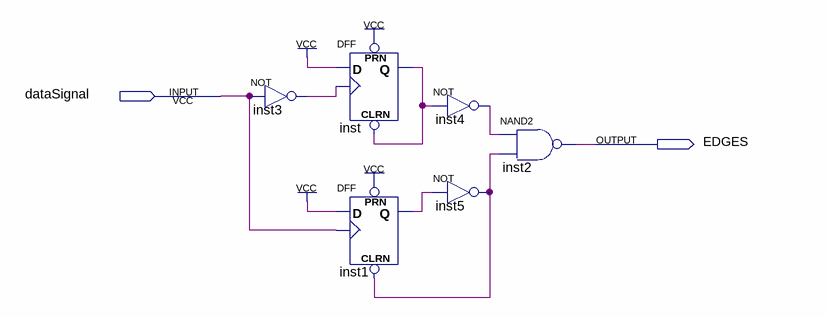
[diagram p0: schematic sheet]
// Quartus schematic edgeDetector.bdf as structural Verilog: 6 symbols, 2 pins
module edgeDetector (
  input  dataSignal,
  output EDGES
);

  wire inst1_q, inst3_out, inst4_out, inst5_out, inst_q;

  not inst3 (inst3_out, dataSignal);
  DFF inst (.CLRN(inst_q), .CLK(inst3_out), .D(1'b1), .PRN(1'b1), .Q(inst_q));
  DFF inst1 (.CLRN(inst5_out), .CLK(dataSignal), .D(1'b1), .PRN(1'b1), .Q(inst1_q));
  not inst4 (inst4_out, inst_q);
  not inst5 (inst5_out, inst1_q);
  nand inst2 (EDGES, inst4_out, inst5_out);
endmodule
